# Altium schematic sheet IV_sensing.SchDoc: Triumvi - Sensing
size Letter; Author: Ye-Sheng Kuo; Revision: 11; SheetNumber: 5; SheetTotal: 10
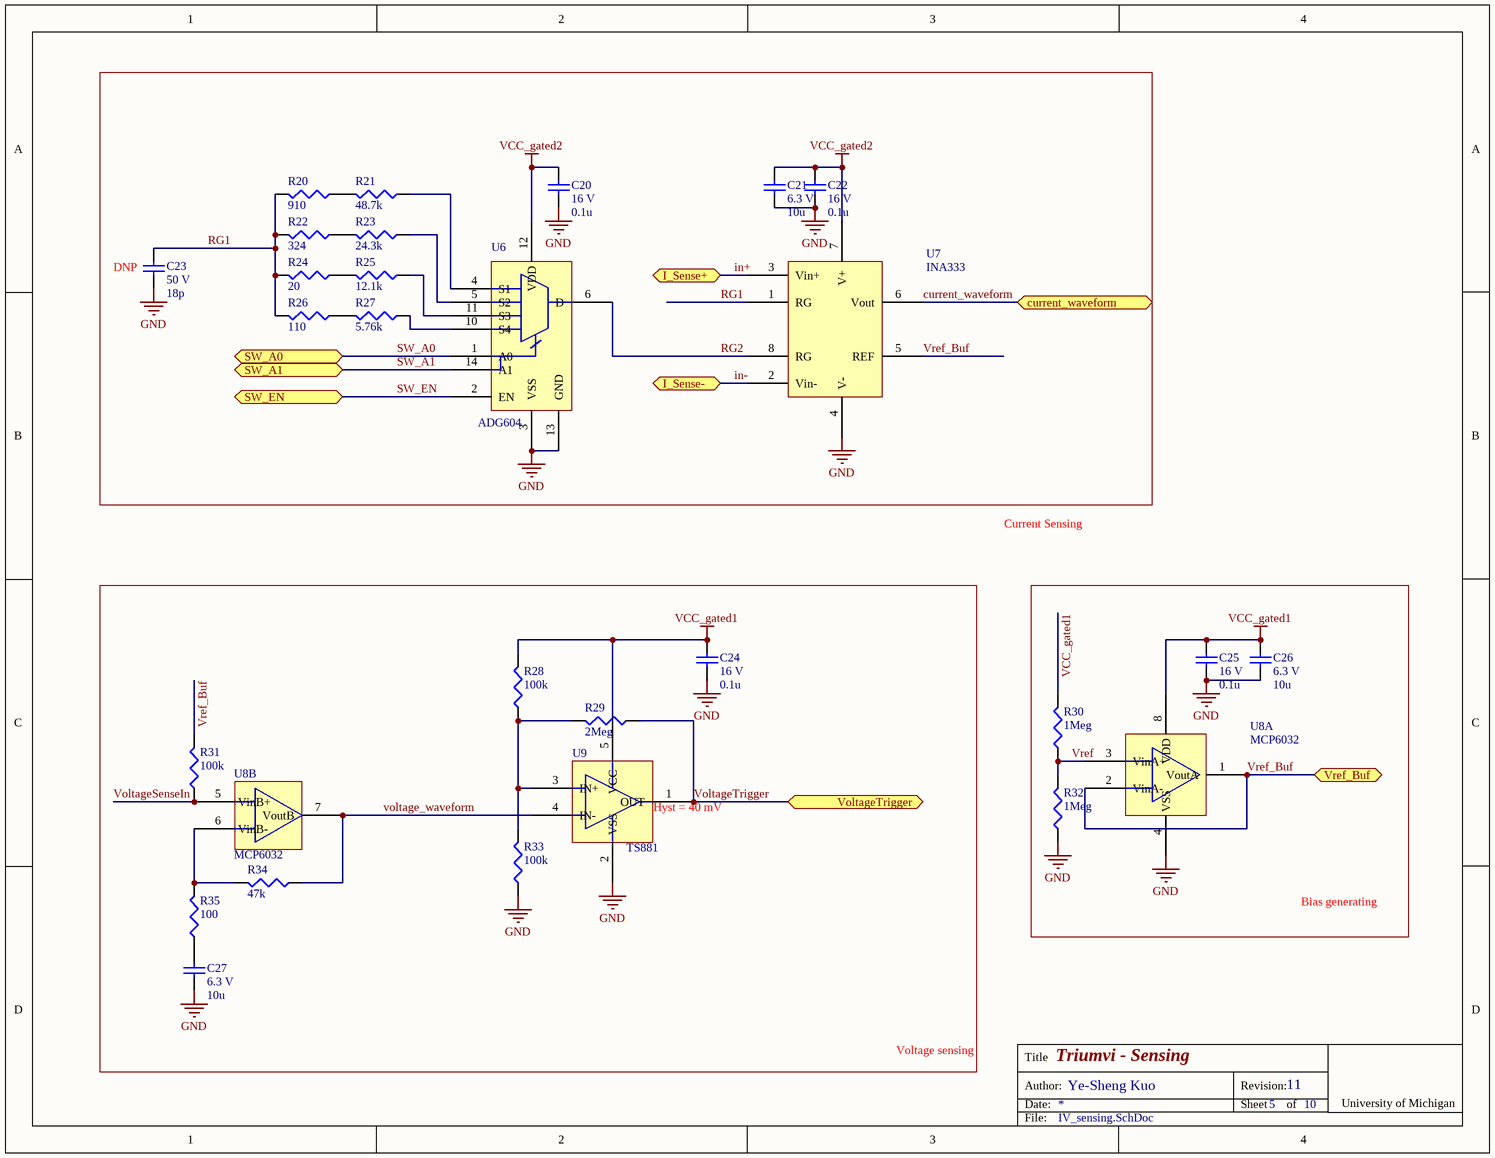
[diagram p0: IV_sensing.SchDoc]

## Parts
C20  voltage rated: 16 V  [0402]  (hidden comment: 0.1u)
C21  voltage rated: 6.3 V  [0603]  (hidden comment: 10u)
C22  voltage rated: 16 V  [0402]  (hidden comment: 0.1u)
C23  voltage rated: 50 V  [0402]  (hidden comment: 18p)
C24  voltage rated: 16 V  [0402]  (hidden comment: 0.1u)
C25  voltage rated: 16 V  [0402]  (hidden comment: 0.1u)
C26  voltage rated: 6.3 V  [0603]  (hidden comment: 10u)
C27  voltage rated: 6.3 V  [0603]  (hidden comment: 10u)
R20  910  [0402]
R21  48.7k  [0402]
R22  324  [0402]
R23  24.3k  [0402]
R24  20  [0402]
R25  12.1k  [0402]
R26  110  [0402]
R27  5.76k  [0402]
R28  100k  [0402]
R29  2Meg  [0402]
R30  1Meg  [0402]
R31  100k  [0402]
R32  1Meg  [0402]
R33  100k  [0402]
R34  47k  [0402]
R35  100  [0402]
U6  ADG604  [TSSOP-14]
U7  INA333  [MSOP-8]
U8  MCP6032  [MSOP-8]  (parts A,B of 2)
U9  TS881  [SC70-5]

## Blocks framed on the sheet
DNP: C20-C23 R20-R27 U6 U7
Bias generating: C25 C26 R30 R32 U8

## Ports
current_waveform, I_Sense+, I_Sense-, SW_A0, SW_A1, SW_EN, VoltageTrigger, Vref_Buf

## Nets
GND: C20.2 C21.2 C22.2 C23.2 C24.2 C25.2 C26.2 C27.2 R32.2 R33.2 U6.3(VSS) U6.13(GND) U7.4(V-) U8.4(VSS) U9.2(VSS)
VCC_gated1: C24.1 C25.1 C26.1 R28.1 R30.1 U8.8(VDD) U9.5(VCC)
VCC_gated2: C20.1 C21.1 C22.1 U6.12(VDD) U7.7(V+)
current_waveform: U7.6(Vout) ; port current_waveform
in+: U7.3(Vin+) ; port I_Sense+
in-: U7.2(Vin-) ; port I_Sense-
RG1: C23.1 R20.1 R22.1 R24.1 R26.1 U7.1(RG)
RG2: U6.6(D) U7.8(RG)
SW_A0: U6.1(A0) ; port SW_A0
SW_A1: U6.14(A1) ; port SW_A1
SW_EN: U6.2(EN) ; port SW_EN
voltage_waveform: R34.2 U8.7(VoutB) U9.4(IN-)
VoltageSenseIn: R31.2 U8.5(VinB+)
VoltageTrigger: R29.2 U9.1(OUT) ; port VoltageTrigger
Vref: R30.2 R32.1 U8.3(VinA+)
Vref_Buf: R31.1 U7.5(REF) U8.1(VoutA) U8.2(VinA-) ; port Vref_Buf
NetC27_1: C27.1 R35.2
NetR20_2: R20.2 R21.1
NetR21_2: R21.2 U6.4(S1)
NetR22_2: R22.2 R23.1
NetR23_2: R23.2 U6.5(S2)
NetR24_2: R24.2 R25.1
NetR25_2: R25.2 U6.11(S3)
NetR26_2: R26.2 R27.1
NetR27_2: R27.2 U6.10(S4)
NetR28_2: R28.2 R29.1 R33.1 U9.3(IN+)
NetR34_1: R34.1 R35.1 U8.6(VinB-)

## Notes on the sheet
- Current Sensing
- (near U9) Hyst = 40 mV
- Voltage sensing
- Title
- Date:
- Author:
- Revision:
- Sheet
- of
- University of Michigan
- File:

## Library data of the parts
C20 C22 C24 C25 = GRM155R71C104KA88D: 0.10µF ±10% 16V Ceramic Capacitor X7R 0402; Manufacture: Murata; tolerance: 10%; package: 0402; Supplier 1: Digi-Key; Supplier Part Number 1: 490-3261-1-ND; Value: 0.1u; Temperature Coefficient: X7R; Manufacturer Part Number: GRM155R71C104KA88D
C21 C26 C27 = C1608X5R0J106M080AB: 10µF ±20% 6.3V Ceramic Capacitor X5R 0603; Manufacture: TDK; tolerance: 20%; package: 0603; Supplier 1: Digi-Key; Supplier Part Number 1: 445-4112-1-ND; Value: 10u; Temperature Coefficient: X5R; Manufacturer Part Number: C1608X5R0J106M080AB
C23 = 500R07S180GV4T: 18pF ±2% 50V Ceramic Capacitor C0G, NP0 0402; Manufacture: Johanson Technology Inc.; Note: DNP; tolerance: 2%; package: 0402; Temperature Coefficient: C0G, NP0; Manufacturer Part Number: 500R07S180GV4T; Supplier 1: Digi-Key; Supplier Part Number 1: 712-1264-1-ND; Value: 18p
R20 = CRCW0402910RFKED: RES SMD 910 OHM 1% 1/16W 0402; Manufacturer: Vishay Dale; Temperature Coefficient: 100 ppm/C; package: 0402; Manufacturer Part Number: CRCW0402910RFKED; Power: 1/16 W; Tolerance: 1%; Supplier 1: Digi-Key; Supplier Part Number 1: 541-910LCT-ND; value: 910
R21 = RT0402DRD0748K7L: RES SMD 48.7K OHM 0.5% 1/16W 0402; Manufacturer: Yageo; Temperature Coefficient: 25 ppm/C; package: 0402; Manufacturer Part Number: RT0402DRD0748K7L; Power: 1/16 W; Tolerance: 0.5%; Supplier 1: Digi-Key; Supplier Part Number 1: 311-2188-1-ND; value: 48.7k
R22 = CRCW0402324RFKED: RES SMD 324 OHM 1% 1/16W 0402; Manufacturer: Vishay Dale; Temperature Coefficient: 100 ppm/C; package: 0402; Manufacturer Part Number: CRCW0402324RFKED; Power: 1/16 W; Tolerance: 1%; Supplier 1: Digi-Key; Supplier Part Number 1: 541-324LCT-ND; value: 324
R23 = RC0402FR-0724K3L: RES SMD 24.3K OHM 0.5% 1/16W 0402; Manufacturer: Yageo; Temperature Coefficient: 100 ppm/C; Tolerance: 1%; package: 0402; Manufacturer Part Number: RC0402FR-0724K3L; Power: 1/16 W; Supplier 1: Digi-Key; Supplier Part Number 1: YAG3071CT-ND; value: 24.3k
R24 = CRCW040220R0FKED: RES SMD 20 OHM 1% 1/16W 0402; Manufacturer: Vishay Dale; Temperature Coefficient: 100 ppm/C; package: 0402; Manufacturer Part Number: CRCW040220R0FKED; Power: 1/16 W; Tolerance: 1%; Supplier 1: Digi-Key; Supplier Part Number 1: 541-20.0LCT-ND; value: 20
R25 = CRCW040212K1FKED: RES SMD 12.1K OHM 1% 1/16W 0402; Manufacturer: Vishay Dale; Temperature Coefficient: 100 ppm/C; package: 0402; Manufacturer Part Number: CRCW040212K1FKED; Power: 1/16 W; Tolerance: 1%; Supplier 1: Digi-Key; Supplier Part Number 1: 541-12.1KLCT-ND; value: 12.1k
R26 = CRCW0402110RFKED: RES SMD 110 OHM 1% 1/16W 0402; Manufacturer: Vishay Dale; Temperature Coefficient: 100 ppm/C; package: 0402; Manufacturer Part Number: CRCW0402110RFKED; Power: 1/16 W; Tolerance: 1%; Supplier 1: Digi-Key; Supplier Part Number 1: 541-110LCT-ND; value: 110
R27 = RC0402FR-075K76L: RES SMD 5.76K OHM 0.5% 1/16W 0402; Manufacturer: Yageo; Temperature Coefficient: 100 ppm/C; Tolerance: 1%; package: 0402; Manufacturer Part Number: RC0402FR-075K76L; Power: 1/16 W; Supplier 1: Digi-Key; Supplier Part Number 1: YAG3196CT-ND; value: 5.76k
R28 R31 R33 = CRCW0402100KFKED: RES SMD 100K OHM 1% 1/16W 0402; Manufacturer: Vishay Dale; Temperature Coefficient: 100 ppm/C; Tolerance: 1%; Power: 1/16 W; Supplier 1: Digi-Key; Supplier Part Number 1: 541-100KLCT-ND; package: 0402; value: 100k; Manufacturer Part Number: CRCW0402100KFKED
R29 = CRCW04022M00FKED: RES SMD 2M OHM 1% 1/16W 0402; Manufacturer: Vishay Dale; Temperature Coefficient: 100 ppm/C; Tolerance: 1%; Power: 1/16 W; package: 0402; Supplier 1: Digi-Key; Supplier Part Number 1: 541-2.00MLCT-ND; value: 2Meg; Manufacturer Part Number: CRCW04022M00FKED
R30 R32 = CRCW04021M00FKED: RES SMD 1M OHM 1% 1/16W 0402; Manufacturer: Vishay Dale; Temperature Coefficient: 100 ppm/C; Tolerance: 1%; Power: 1/16 W; Supplier 1: Digi-Key; Supplier Part Number 1: 541-1.00MLCT-ND; package: 0402; value: 1Meg; Manufacturer Part Number: CRCW04021M00FKED
R34 = CRCW040247K0FKED: RES SMD 47K OHM 1% 1/16W 0402; Manufacturer: Vishay Dale; Temperature Coefficient: 100 ppm/C; Tolerance: 1%; Power: 1/16 W; package: 0402; Supplier 1: Digi-Key; Supplier Part Number 1: 541-47.0KLCT-ND; value: 47k; Manufacturer Part Number: CRCW040247K0FKED
R35 = CRCW0402100RFKED: RES SMD 100 OHM 1% 1/16W 0402; Manufacturer: Vishay Dale; Temperature Coefficient: 100 ppm/C; Tolerance: 1%; Power: 1/16 W; package: 0402; Supplier 1: Digi-Key; Supplier Part Number 1: 541-100LCT-ND; value: 100; Manufacturer Part Number: CRCW0402100RFKED
U6 = ADG604: 1 pC Charge Injection, 100 pA Leakage  CMOS  5 V/5 V/3 V 4-Channel Multiplexer; Supplier 1: Digi-Key; Supplier Part Number 1: ADG604YRUZ-ND
U7 = INA333: Micro-Power (50uA), Zero-Drift, Rail-to-Rail Out  Instrumentation Amplifier; Supplier 1: Digi-Key; Supplier Part Number 1: 296-23564-1-ND
U8 = MCP6032: 0.9 µA, High Precision Op Amps; Supplier 1: Digi-Key; Supplier Part Number 1: MCP6032-E/MS-ND
U9 = TS881: Rail-to-rail 0.9 V nanopower comparator; Supplier 1: Digi-Key; Supplier Part Number 1: 497-13217-1-ND